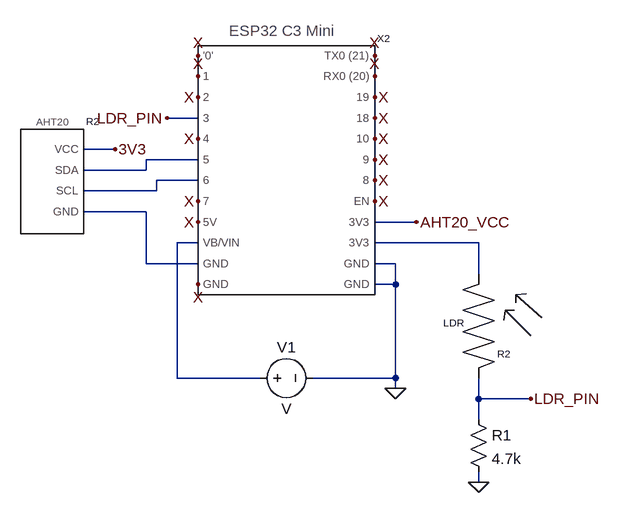
[diagram p0: schematic transmitter.asc]
transmitter.asc, the LTspice schematic file:
Version 4.1
SHEET 1 880 680
WIRE -272 -112 -320 -112
WIRE -400 -64 -448 -64
WIRE -272 -48 -352 -48
WIRE -352 -32 -352 -48
WIRE -352 -32 -448 -32
WIRE -272 -16 -336 -16
WIRE -336 0 -336 -16
WIRE -336 0 -448 0
WIRE -352 32 -448 32
WIRE 64 48 0 48
WIRE -272 80 -304 80
WIRE 160 80 0 80
WIRE -352 112 -352 32
WIRE -272 112 -352 112
WIRE 32 112 0 112
WIRE 160 128 160 80
WIRE 32 144 32 112
WIRE 32 144 0 144
WIRE -304 288 -304 80
WIRE -176 288 -304 288
WIRE 32 288 32 144
WIRE 32 288 -96 288
WIRE 32 304 32 288
WIRE 160 320 160 288
WIRE 240 320 160 320
WIRE 160 352 160 320
WIRE 160 448 160 432
FLAG 32 304 0
FLAG -400 -64 3V3
FLAG 64 48 AHT20_VCC
FLAG -320 -112 LDR_PIN
FLAG 240 320 LDR_PIN
FLAG 160 448 0
FLAG -272 -208 X
FLAG -272 -176 X
FLAG -272 -144 X
FLAG -272 -80 X
FLAG -272 16 X
FLAG -272 48 X
FLAG 0 16 X
FLAG 0 -16 X
FLAG 0 -48 X
FLAG 0 -80 X
FLAG 0 -112 X
FLAG 0 -144 X
FLAG 0 -176 X
FLAG 0 -208 X
FLAG -272 144 X
SYMBOL symbols\\AHT20 -368 0 R0
SYMATTR InstName R2
SYMBOL voltage -192 288 R270
WINDOW 0 32 56 VTop 2
WINDOW 3 -32 56 VBottom 2
SYMATTR InstName V1
SYMBOL res 144 336 R0
SYMATTR InstName R1
SYMATTR Value 4.7k
SYMBOL symbols\\LDR 224 272 R0
SYMATTR InstName R2
SYMBOL symbols\\esp32_c3_mini -224 -144 R0
SYMATTR InstName X2

The netlist it stands for:
* transmitter.asc
R2 3V3 N001 N002 N003
V1 N004 0 V
R1 LDR_PIN 0 4.7k
R2 LDR_PIN N005 LDR
X§X2 X X X LDR_PIN X N001 N002 X X N004 N003 X X X X X X X X X AHT20_VCC N005 0 0 esp32_c3_mini  ; pins '0' 1 2 3 4 5 6 7 5V VB/VIN GND GND TX0_(21) RX0_(20) 19 18 10 9 8 EN 3V3 3V3 GND GND
.backanno
.end